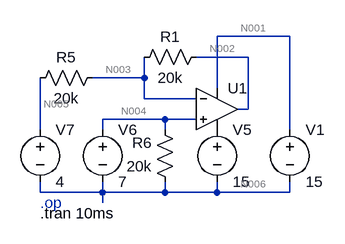
[diagram p0: schematic subtractor.asc]
subtractor.asc, the LTspice schematic file:
Version 4
SHEET 1 880 680
WIRE 352 96 240 96
WIRE 288 128 208 128
WIRE 128 160 128 128
WIRE 128 160 48 160
WIRE 240 176 240 96
WIRE 128 192 128 160
WIRE 208 192 128 192
WIRE 288 208 288 128
WIRE 288 208 272 208
WIRE 160 224 64 224
WIRE 208 224 160 224
WIRE -32 240 -32 160
WIRE 64 240 64 224
WIRE 160 240 160 224
WIRE 352 240 352 96
WIRE -32 336 -32 320
WIRE 64 336 64 320
WIRE 64 336 -32 336
WIRE 160 336 160 320
WIRE 160 336 64 336
WIRE 240 336 240 320
WIRE 240 336 160 336
WIRE 352 336 352 320
WIRE 352 336 240 336
WIRE 64 352 64 336
SYMBOL voltage 352 224 R0
SYMATTR InstName V1
SYMATTR Value 15
SYMBOL res 224 112 R90
WINDOW 0 0 56 VBottom 2
WINDOW 3 32 56 VTop 2
SYMATTR InstName R1
SYMATTR Value 20k
SYMBOL OpAmps\\UniversalOpAmp 240 208 R0
SYMATTR InstName U1
SYMBOL voltage 240 224 R0
SYMATTR InstName V5
SYMATTR Value 15
SYMBOL voltage 64 224 R0
SYMATTR InstName V6
SYMATTR Value 7
SYMBOL voltage -32 224 R0
SYMATTR InstName V7
SYMATTR Value 4
SYMBOL res 64 144 R90
WINDOW 0 0 56 VBottom 2
WINDOW 3 32 56 VTop 2
SYMATTR InstName R5
SYMATTR Value 20k
SYMBOL res 176 336 R180
WINDOW 0 36 76 Left 2
WINDOW 3 36 40 Left 2
SYMATTR InstName R6
SYMATTR Value 20k
TEXT -32 352 Left 2 ;.op
TEXT -32 368 Left 2 !.tran 10ms

The netlist it stands for:
* subtractor.asc
V1 N001 N006 15
R1 N002 N003 20k
XU1 N004 N003 N001 P001 N002 level1 Avol=1Meg GBW=10Meg Vos=0 En=0 Enk=0 In=0 Ink=0 Rin=500Meg  ; pins In+ In- V+ V- OUT
V5 P001 N006 15
V6 N004 N006 7
V7 N005 N006 4
R5 N003 N005 20k
R6 N006 N004 20k
* .op
.tran 10ms
.lib UniversalOpAmp1.lib
.backanno
.end

* Results of the author's LTspice run, read from the files saved beside the schematic
* Operating Point, zero values left out:
*   V(n001) = 3 MV
*   V(n006) = 3 MV
*   V(n002) = 3 MV
*   V(n003) = 3 MV
*   V(n004) = 3 MV
*   V(p001) = 3 MV
*   V(n005) = 3 MV
*   I(R1) = -3.11 nA
*   I(R5) = 22 nA
*   I(R6) = -350 µA
*   I(V1) = -19 nA
*   I(V5) = -19 nA
*   I(V6) = -350 µA
*   I(V7) = 22 nA
*   Ix(u1:1) = -16 nA
*   Ix(u1:2) = -22 nA
*   Ix(u1:3) = 19 nA
*   Ix(u1:4) = 19 nA
*   Ix(u1:5) = 4.394 mA